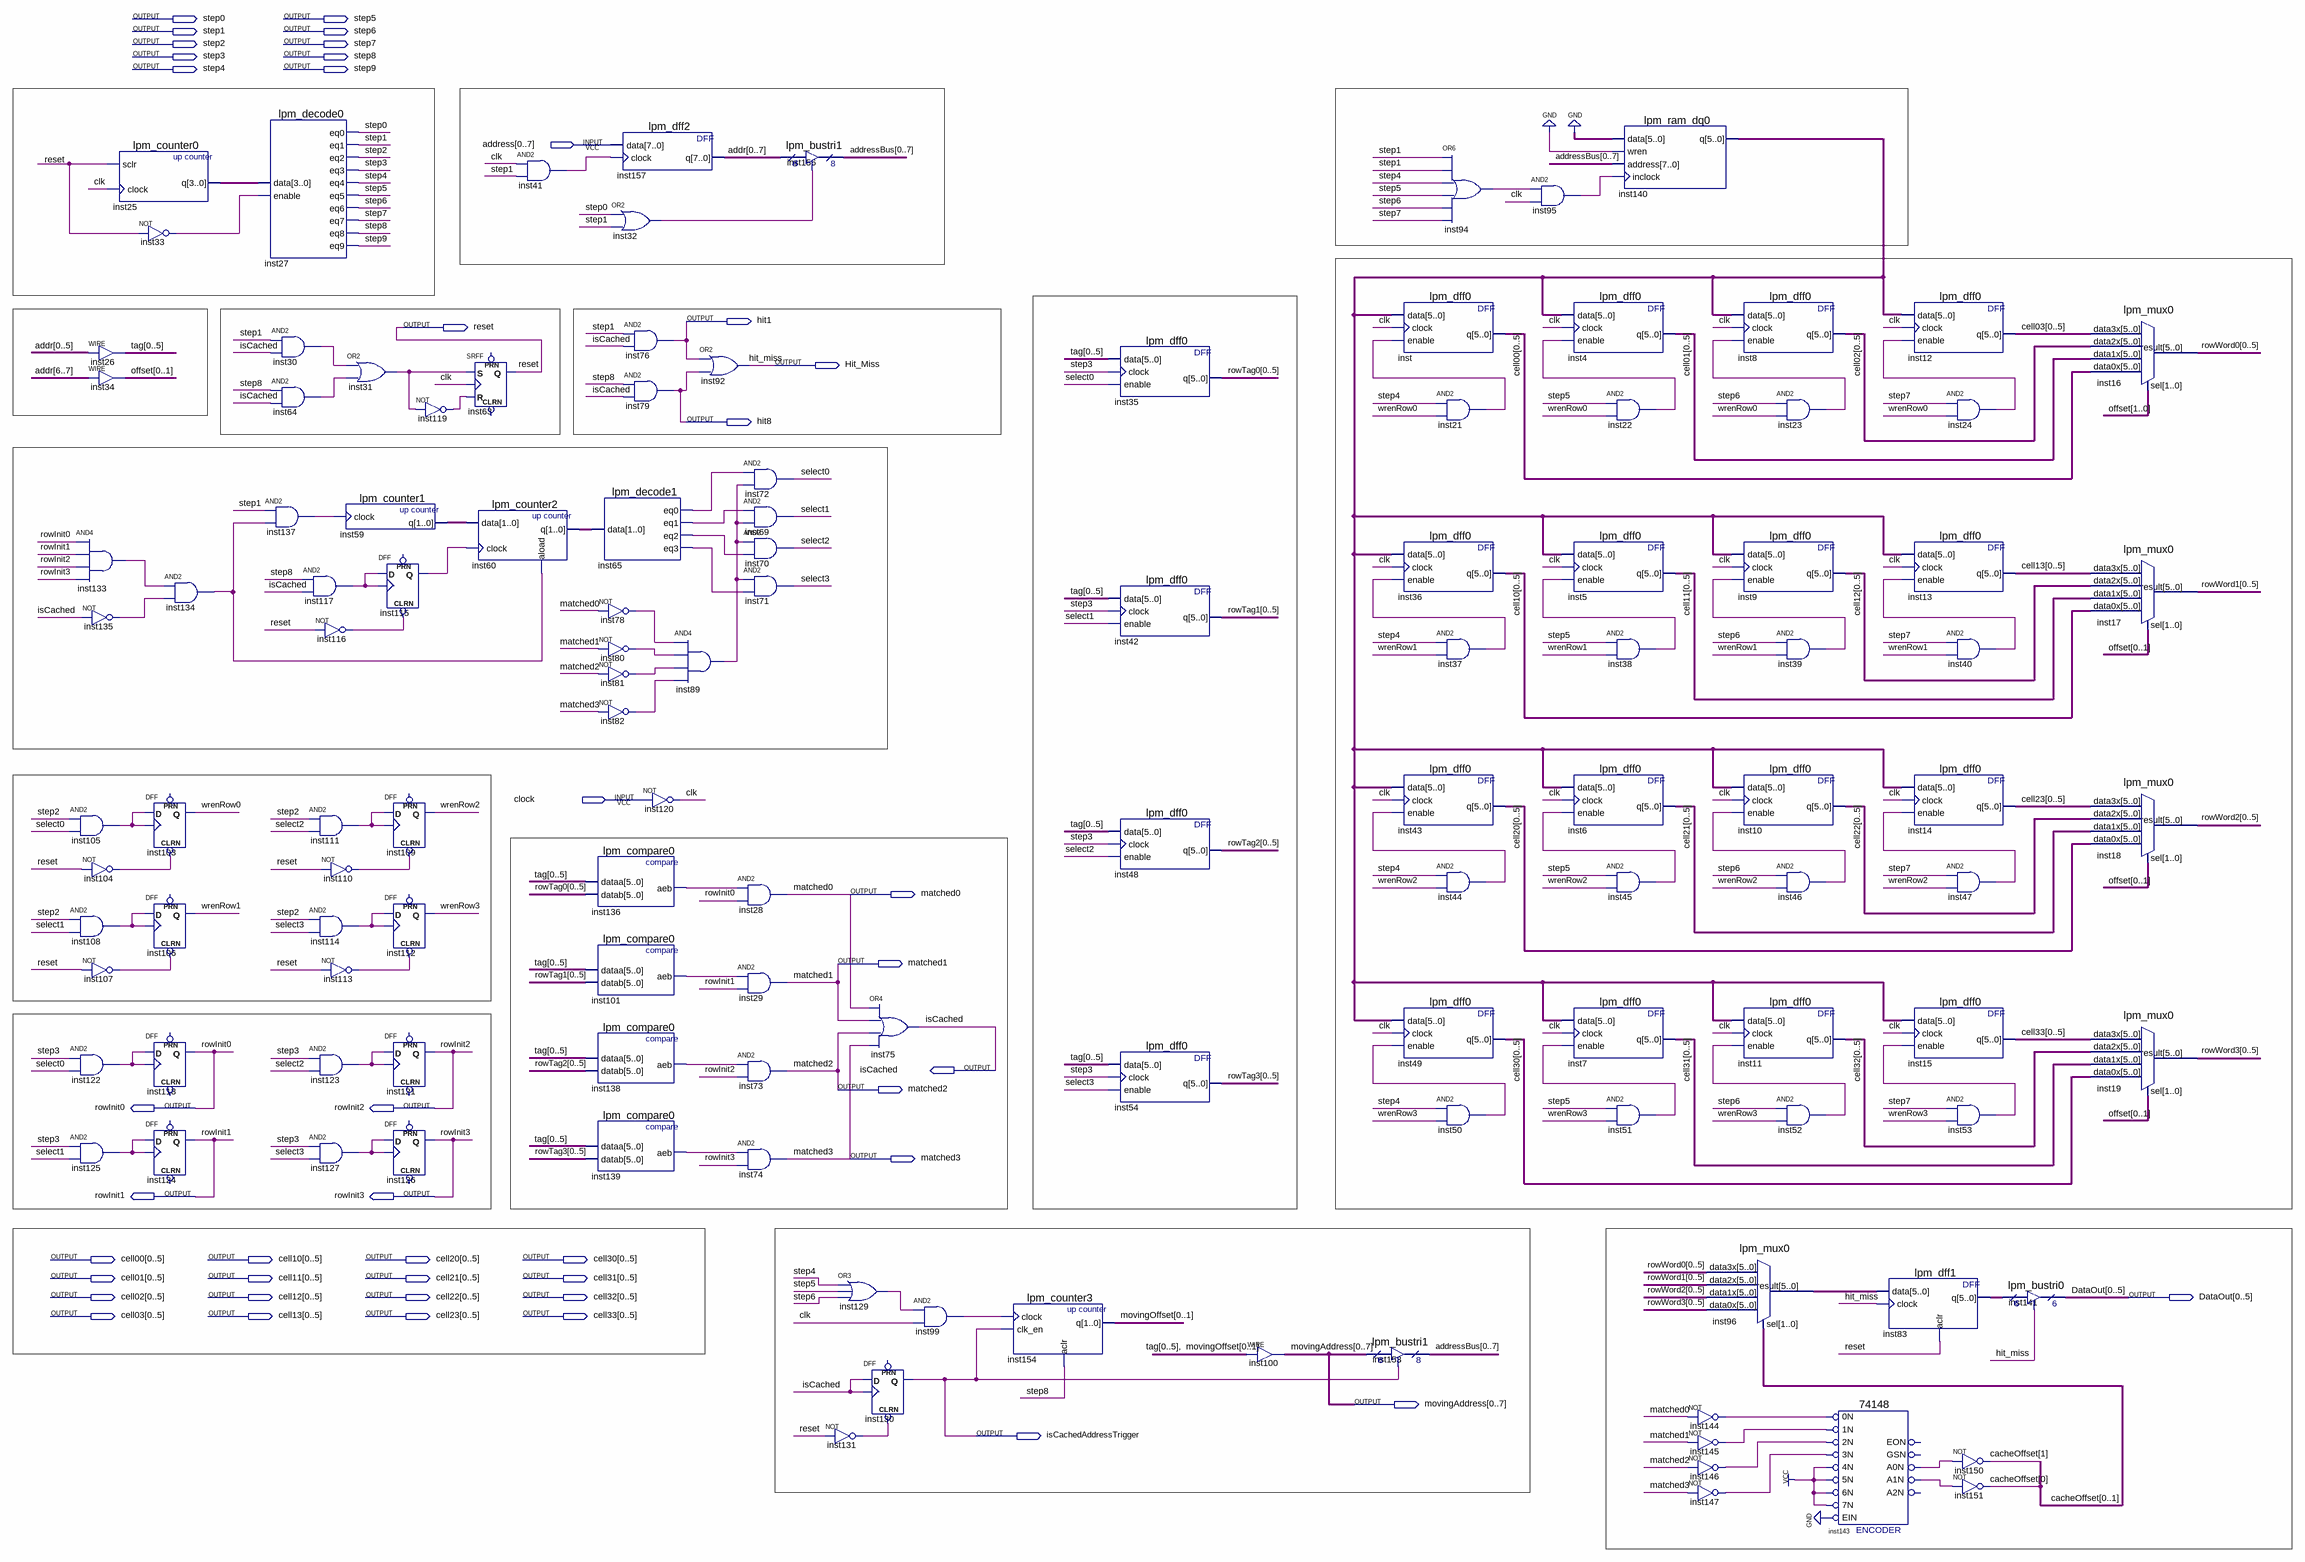
[diagram p0: schematic sheet]
// Quartus schematic Cache.bdf as structural Verilog: 126 symbols, 44 pins
module Cache (
  input  [0:7] address,
  input  clock,
  output step0,
  output step5,
  output step1,
  output step6,
  output step2,
  output step7,
  output step3,
  output step8,
  output step4,
  output step9,
  output hit1,
  output reset,
  output Hit_Miss,
  output hit8,
  output matched0,
  output matched1,
  output isCached,
  output matched2,
  output rowInit0,
  output rowInit2,
  output matched3,
  output rowInit1,
  output rowInit3,
  output [0:5] cell00,
  output [0:5] cell10,
  output [0:5] cell20,
  output [0:5] cell30,
  output [0:5] cell01,
  output [0:5] cell11,
  output [0:5] cell21,
  output [0:5] cell31,
  output [0:5] cell02,
  output [0:5] cell12,
  output [0:5] cell22,
  output [0:5] cell32,
  output [0:5] DataOut,
  output [0:5] cell03,
  output [0:5] cell13,
  output [0:5] cell23,
  output [0:5] cell33,
  output [0:7] movingAddress,
  output isCachedAddressTrigger
);

  wire clk, inst21_out, inst22_out, inst23_out, inst24_out, inst30_out, inst31_out, inst32_out, inst33_out,
       inst37_out, inst38_out, inst39_out, inst40_out, inst41_out, inst44_out, inst45_out, inst46_out,
       inst47_out, inst50_out, inst51_out, inst52_out, inst53_out, inst64_out, inst65_eq0, inst65_eq1,
       inst65_eq2, inst65_eq3, inst78_out, inst80_out, inst81_out, inst82_out, inst89_out, inst94_out,
       inst95_out, inst99_out, inst101_aeb, inst104_out, inst105_out, inst107_out, inst108_out, inst110_out,
       inst111_out, inst113_out, inst114_out, inst115_q, inst116_out, inst117_out, inst119_out, inst122_out,
       inst123_out, inst125_out, inst127_out, inst129_out, inst131_out, inst133_out, inst134_out,
       inst135_out, inst136_aeb, inst137_out, inst138_aeb, inst139_aeb, inst143_a0n, inst143_a1n,
       inst144_out, inst145_out, inst146_out, inst147_out, select0, select1, select2, select3, wrenRow0,
       wrenRow1, wrenRow2, wrenRow3;
  wire [1:0] cacheOffset, inst59_q, inst60_q, movingOffset, offset;
  wire [3:0] inst25_q;
  wire [5:0] inst83_q, inst96_result, inst140_q, rowTag0, rowTag1, rowTag2, rowTag3, rowWord0, rowWord1,
       rowWord2, rowWord3, tag;
  wire [7:0] addr, addressBus;

  and inst105 (inst105_out, step2, select0);
  and inst108 (inst108_out, step2, select1);
  and inst122 (inst122_out, step3, select0);
  and inst125 (inst125_out, step3, select1);
  lpm_counter0 inst25 (.sclr(reset), .clock(clk), .q(inst25_q));
  assign {tag[0], tag[1], tag[2], tag[3], tag[4], tag[5]} = {addr[0], addr[1], addr[2], addr[3], addr[4], addr[5]};  // WIRE inst26
  assign {offset[0], offset[1]} = {addr[6], addr[7]};  // WIRE inst34
  and inst133 (inst133_out, rowInit0, rowInit1, rowInit2, rowInit3);
  not inst135 (inst135_out, isCached);
  not inst104 (inst104_out, reset);
  not inst107 (inst107_out, reset);
  not inst33 (inst33_out, reset);
  and inst134 (inst134_out, inst133_out, inst135_out);
  DFF inst103 (.CLRN(inst104_out), .CLK(inst105_out), .D(inst105_out), .Q(wrenRow0));  // open: PRN
  DFF inst106 (.CLRN(inst107_out), .CLK(inst108_out), .D(inst108_out), .Q(wrenRow1));  // open: PRN
  DFF inst118 (.CLK(inst122_out), .D(inst122_out), .Q(rowInit0));  // open: CLRN, PRN
  DFF inst124 (.CLK(inst125_out), .D(inst125_out), .Q(rowInit1));  // open: CLRN, PRN
  lpm_decode0 inst27 (
    .data(inst25_q), .enable(inst33_out), .eq0(step0), .eq1(step1), .eq2(step2), .eq3(step3), .eq4(step4),
    .eq5(step5), .eq6(step6), .eq7(step7), .eq8(step8), .eq9(step9));
  and inst30 (inst30_out, step1, isCached);
  and inst64 (inst64_out, step8, isCached);
  and inst137 (inst137_out, step1, inst134_out);
  and inst117 (inst117_out, step8, isCached);
  not inst116 (inst116_out, reset);
  and inst111 (inst111_out, step2, select2);
  not inst110 (inst110_out, reset);
  and inst114 (inst114_out, step2, select3);
  not inst113 (inst113_out, reset);
  and inst123 (inst123_out, step3, select2);
  and inst127 (inst127_out, step3, select3);
  or inst31 (inst31_out, inst30_out, inst64_out);
  lpm_counter1 inst59 (.clock(inst137_out), .q(inst59_q));
  not inst119 (inst119_out, inst31_out);
  DFF inst115 (.CLRN(inst116_out), .CLK(inst117_out), .D(inst117_out), .Q(inst115_q));  // open: PRN
  DFF inst109 (.CLRN(inst110_out), .CLK(inst111_out), .D(inst111_out), .Q(wrenRow2));  // open: PRN
  DFF inst112 (.CLRN(inst113_out), .CLK(inst114_out), .D(inst114_out), .Q(wrenRow3));  // open: PRN
  DFF inst121 (.CLK(inst123_out), .D(inst123_out), .Q(rowInit2));  // open: CLRN, PRN
  DFF inst126 (.CLK(inst127_out), .D(inst127_out), .Q(rowInit3));  // open: CLRN, PRN
  SRFF inst63 (.S(inst31_out), .R(inst119_out), .CLK(clk), .Q(reset));  // open: PRN, CLRN
  lpm_counter2 inst60 (.data(inst59_q), .clock(inst115_q), .aload(inst134_out), .q(inst60_q));
  and inst41 (inst41_out, clk, step1);
  lpm_dff2 inst157 (
    .data(address), .clock(inst41_out),
    .q({addr[0], addr[1], addr[2], addr[3], addr[4], addr[5], addr[6], addr[7]}));
  or inst32 (inst32_out, step0, step1);
  and inst76 (hit1, step1, isCached);
  and inst79 (hit8, step8, isCached);
  lpm_decode1 inst65 (.data(inst60_q), .eq0(inst65_eq0), .eq1(inst65_eq1), .eq2(inst65_eq2), .eq3(inst65_eq3));
  not inst78 (inst78_out, matched0);
  not inst80 (inst80_out, matched1);
  not inst81 (inst81_out, matched2);
  not inst82 (inst82_out, matched3);
  lpm_compare0 inst136 (
    .dataa({tag[0], tag[1], tag[2], tag[3], tag[4], tag[5]}),
    .datab({rowTag0[0], rowTag0[1], rowTag0[2], rowTag0[3], rowTag0[4], rowTag0[5]}), .aeb(inst136_aeb));
  lpm_compare0 inst101 (
    .dataa({tag[0], tag[1], tag[2], tag[3], tag[4], tag[5]}),
    .datab({rowTag1[0], rowTag1[1], rowTag1[2], rowTag1[3], rowTag1[4], rowTag1[5]}), .aeb(inst101_aeb));
  lpm_compare0 inst138 (
    .dataa({tag[0], tag[1], tag[2], tag[3], tag[4], tag[5]}),
    .datab({rowTag2[0], rowTag2[1], rowTag2[2], rowTag2[3], rowTag2[4], rowTag2[5]}), .aeb(inst138_aeb));
  lpm_compare0 inst139 (
    .dataa({tag[0], tag[1], tag[2], tag[3], tag[4], tag[5]}),
    .datab({rowTag3[0], rowTag3[1], rowTag3[2], rowTag3[3], rowTag3[4], rowTag3[5]}), .aeb(inst139_aeb));
  and inst89 (inst89_out, inst78_out, inst80_out, inst81_out, inst82_out);
  not inst120 (clk, clock);
  or inst92 (Hit_Miss, hit1, hit8);
  and inst72 (select0, inst65_eq0, inst89_out);
  and inst69 (select1, inst65_eq1, inst89_out);
  and inst70 (select2, inst89_out, inst65_eq2);
  and inst71 (select3, inst89_out, inst65_eq3);
  and inst28 (matched0, inst136_aeb, rowInit0);
  and inst29 (matched1, inst101_aeb, rowInit1);
  and inst73 (matched2, inst138_aeb, rowInit2);
  and inst74 (matched3, inst139_aeb, rowInit3);
  lpm_bustri1 inst156 (
    .enabledt(inst32_out), .data({addr[0], addr[1], addr[2], addr[3], addr[4], addr[5], addr[6], addr[7]}),
    .tridata({addressBus[0], addressBus[1], addressBus[2], addressBus[3], addressBus[4], addressBus[5], addressBus[6], addressBus[7]}));
  not inst131 (inst131_out, reset);
  or inst75 (isCached, matched0, matched1, matched2, matched3);
  or inst129 (inst129_out, step4, step5, step6);
  DFF inst130 (.CLRN(inst131_out), .CLK(isCached), .D(isCached), .Q(isCachedAddressTrigger));  // open: PRN
  and inst99 (inst99_out, inst129_out, clk);
  lpm_counter3 inst154 (
    .clock(inst99_out), .clk_en(isCachedAddressTrigger), .aclr(step8), .q({movingOffset[0], movingOffset[1]}));
  lpm_dff0 inst35 (
    .data({tag[0], tag[1], tag[2], tag[3], tag[4], tag[5]}), .clock(step3), .enable(select0),
    .q({rowTag0[0], rowTag0[1], rowTag0[2], rowTag0[3], rowTag0[4], rowTag0[5]}));
  lpm_dff0 inst42 (
    .data({tag[0], tag[1], tag[2], tag[3], tag[4], tag[5]}), .clock(step3), .enable(select1),
    .q({rowTag1[0], rowTag1[1], rowTag1[2], rowTag1[3], rowTag1[4], rowTag1[5]}));
  lpm_dff0 inst48 (
    .data({tag[0], tag[1], tag[2], tag[3], tag[4], tag[5]}), .clock(step3), .enable(select2),
    .q({rowTag2[0], rowTag2[1], rowTag2[2], rowTag2[3], rowTag2[4], rowTag2[5]}));
  lpm_dff0 inst54 (
    .data({tag[0], tag[1], tag[2], tag[3], tag[4], tag[5]}), .clock(step3), .enable(select3),
    .q({rowTag3[0], rowTag3[1], rowTag3[2], rowTag3[3], rowTag3[4], rowTag3[5]}));
  assign movingAddress = {tag[0], tag[1], tag[2], tag[3], tag[4], tag[5], movingOffset[0], movingOffset[1]};  // WIRE inst100
  lpm_bustri1 inst153 (
    .enabledt(isCachedAddressTrigger), .data(movingAddress),
    .tridata({addressBus[0], addressBus[1], addressBus[2], addressBus[3], addressBus[4], addressBus[5], addressBus[6], addressBus[7]}));
  lpm_dff0 inst (.data(inst140_q), .clock(clk), .enable(inst21_out), .q(cell00));
  lpm_dff0 inst36 (.data(inst140_q), .clock(clk), .enable(inst37_out), .q(cell10));
  lpm_dff0 inst43 (.data(inst140_q), .clock(clk), .enable(inst44_out), .q(cell20));
  lpm_dff0 inst49 (.data(inst140_q), .clock(clk), .enable(inst50_out), .q(cell30));
  or inst94 (inst94_out, step1, step1, step4, step5, step6, step7);
  and inst21 (inst21_out, step4, wrenRow0);
  and inst37 (inst37_out, step4, wrenRow1);
  and inst44 (inst44_out, step4, wrenRow2);
  and inst50 (inst50_out, step4, wrenRow3);
  and inst95 (inst95_out, inst94_out, clk);
  lpm_dff0 inst4 (.data(inst140_q), .clock(clk), .enable(inst22_out), .q(cell01));
  lpm_dff0 inst5 (.data(inst140_q), .clock(clk), .enable(inst38_out), .q(cell11));
  lpm_dff0 inst6 (.data(inst140_q), .clock(clk), .enable(inst45_out), .q(cell21));
  lpm_dff0 inst7 (.data(inst140_q), .clock(clk), .enable(inst51_out), .q(cell31));
  lpm_ram_dq0 inst140 (
    .data({6{1'b0}}), .wren(1'b0),
    .address({addressBus[0], addressBus[1], addressBus[2], addressBus[3], addressBus[4], addressBus[5], addressBus[6], addressBus[7]}),
    .inclock(inst95_out), .q(inst140_q));
  and inst22 (inst22_out, step5, wrenRow0);
  and inst38 (inst38_out, step5, wrenRow1);
  and inst45 (inst45_out, step5, wrenRow2);
  and inst51 (inst51_out, step5, wrenRow3);
  lpm_dff0 inst8 (.data(inst140_q), .clock(clk), .enable(inst23_out), .q(cell02));
  lpm_dff0 inst9 (.data(inst140_q), .clock(clk), .enable(inst39_out), .q(cell12));
  lpm_dff0 inst10 (.data(inst140_q), .clock(clk), .enable(inst46_out), .q(cell22));
  lpm_dff0 inst11 (.data(inst140_q), .clock(clk), .enable(inst52_out), .q(cell32));
  lpm_mux0 inst96 (
    .data3x({rowWord0[0], rowWord0[1], rowWord0[2], rowWord0[3], rowWord0[4], rowWord0[5]}),
    .data2x({rowWord1[0], rowWord1[1], rowWord1[2], rowWord1[3], rowWord1[4], rowWord1[5]}),
    .data1x({rowWord2[0], rowWord2[1], rowWord2[2], rowWord2[3], rowWord2[4], rowWord2[5]}),
    .data0x({rowWord3[0], rowWord3[1], rowWord3[2], rowWord3[3], rowWord3[4], rowWord3[5]}),
    .sel({cacheOffset[0], cacheOffset[1]}), .result(inst96_result));
  not inst144 (inst144_out, matched0);
  not inst145 (inst145_out, matched1);
  not inst146 (inst146_out, matched2);
  not inst147 (inst147_out, matched3);
  and inst23 (inst23_out, step6, wrenRow0);
  and inst39 (inst39_out, step6, wrenRow1);
  and inst46 (inst46_out, step6, wrenRow2);
  and inst52 (inst52_out, step6, wrenRow3);
  \74148  inst143 (
    .\5N (1'b1), .\0N (inst144_out), .\1N (inst145_out), .\2N (inst146_out), .\3N (inst147_out), .\4N (1'b1),
    .EIN(1'b0), .\6N (1'b1), .\7N (1'b1), .A1N(inst143_a1n), .A0N(inst143_a0n));  // open: A2N, EON, GSN
  lpm_dff1 inst83 (.data(inst96_result), .clock(Hit_Miss), .aclr(reset), .q(inst83_q));
  lpm_dff0 inst12 (.data(inst140_q), .clock(clk), .enable(inst24_out), .q(cell03));
  lpm_dff0 inst13 (.data(inst140_q), .clock(clk), .enable(inst40_out), .q(cell13));
  lpm_dff0 inst14 (.data(inst140_q), .clock(clk), .enable(inst47_out), .q(cell23));
  lpm_dff0 inst15 (.data(inst140_q), .clock(clk), .enable(inst53_out), .q(cell33));
  and inst24 (inst24_out, step7, wrenRow0);
  and inst40 (inst40_out, step7, wrenRow1);
  and inst47 (inst47_out, step7, wrenRow2);
  and inst53 (inst53_out, step7, wrenRow3);
  not inst150 (cacheOffset[1], inst143_a0n);
  not inst151 (cacheOffset[0], inst143_a1n);
  lpm_bustri0 inst141 (.enabledt(Hit_Miss), .data(inst83_q), .tridata(DataOut));
  lpm_mux0 inst16 (
    .data3x(cell03), .data2x(cell02), .data1x(cell01), .data0x(cell00), .sel(offset),
    .result({rowWord0[0], rowWord0[1], rowWord0[2], rowWord0[3], rowWord0[4], rowWord0[5]}));
  lpm_mux0 inst17 (
    .data3x(cell13), .data2x(cell12), .data1x(cell11), .data0x(cell10), .sel({offset[0], offset[1]}),
    .result({rowWord1[0], rowWord1[1], rowWord1[2], rowWord1[3], rowWord1[4], rowWord1[5]}));
  lpm_mux0 inst18 (
    .data3x(cell23), .data2x(cell22), .data1x(cell21), .data0x(cell20), .sel({offset[0], offset[1]}),
    .result({rowWord2[0], rowWord2[1], rowWord2[2], rowWord2[3], rowWord2[4], rowWord2[5]}));
  lpm_mux0 inst19 (
    .data3x(cell33), .data2x(cell32), .data1x(cell31), .data0x(cell30), .sel({offset[0], offset[1]}),
    .result({rowWord3[0], rowWord3[1], rowWord3[2], rowWord3[3], rowWord3[4], rowWord3[5]}));
endmodule
